# EAGLE schematic stepper  carriers (EAGLE 6.4)
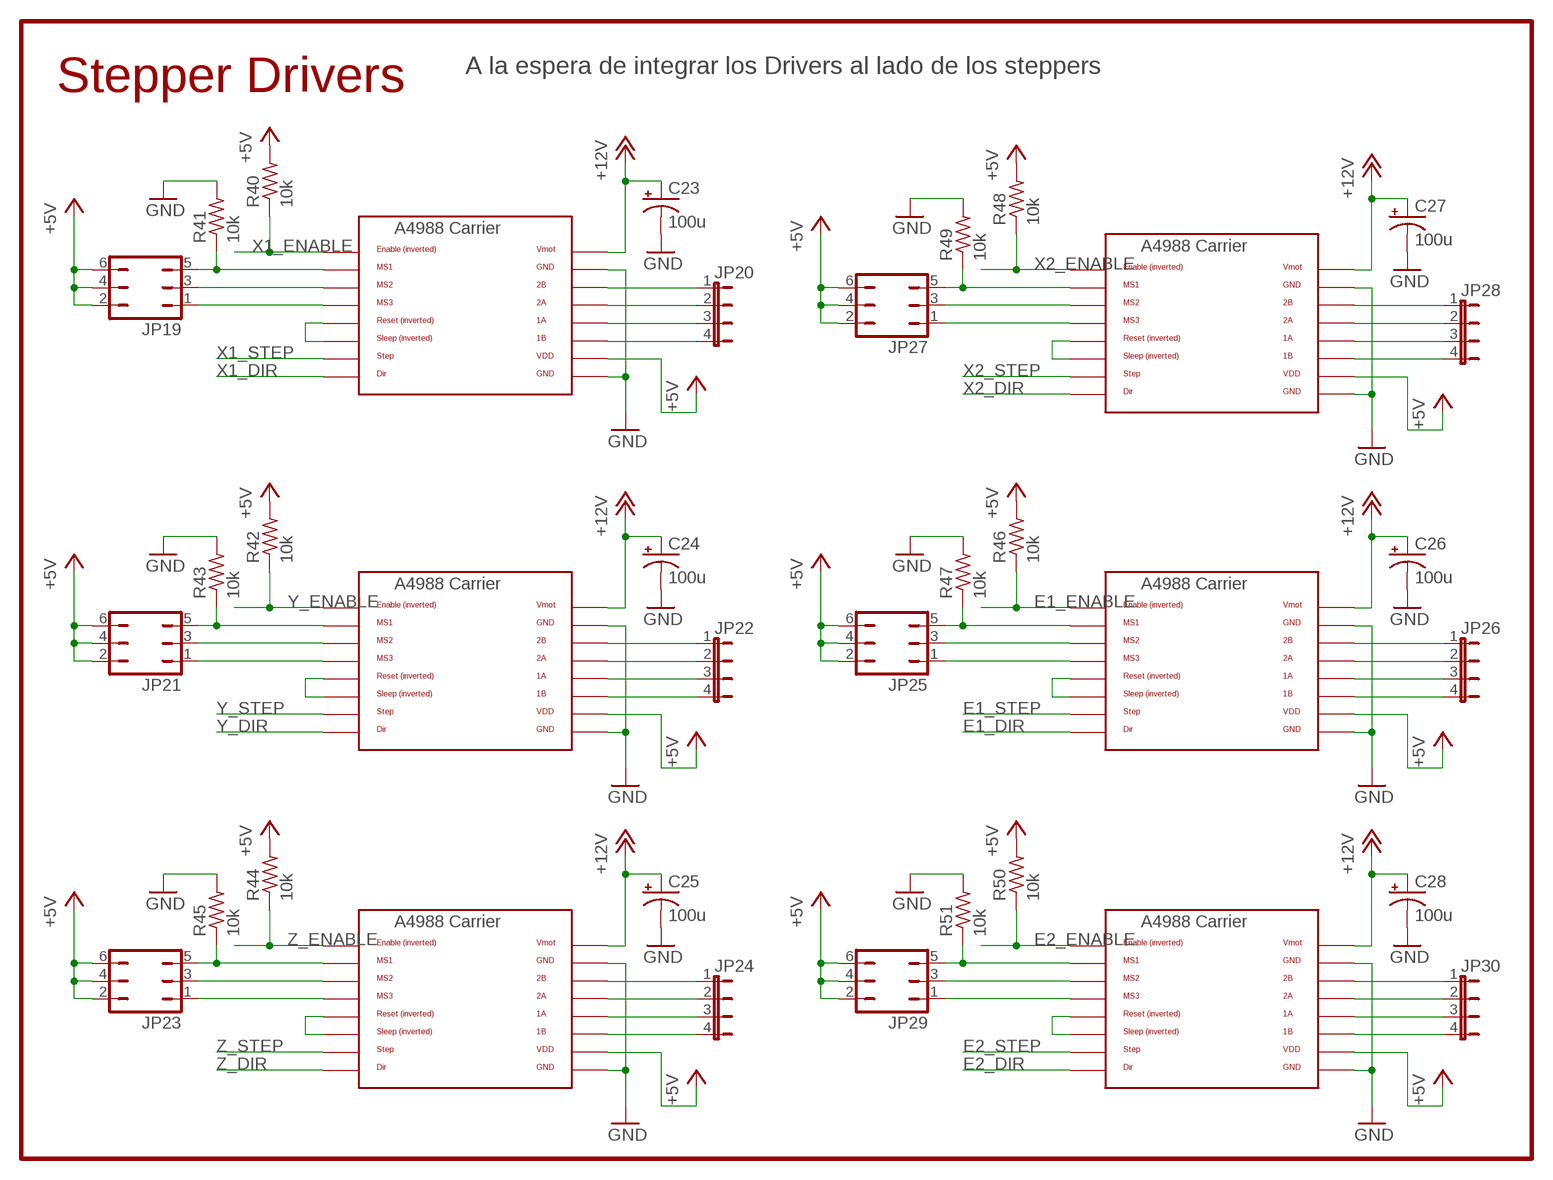
[diagram p0: schematic, sheet 1]

## Parts
C23  100u  CPOL-US140CLH-1010  [140CLH-1010]
C24  100u  CPOL-US140CLH-1010  [140CLH-1010]
C25  100u  CPOL-US140CLH-1010  [140CLH-1010]
C26  100u  CPOL-US140CLH-1010  [140CLH-1010]
C27  100u  CPOL-US140CLH-1010  [140CLH-1010]
C28  100u  CPOL-US140CLH-1010  [140CLH-1010]
JP19  JP3Q  [JP3Q]
JP20  JP4E  [JP4]
JP21  JP3Q  [JP3Q]
JP22  JP4E  [JP4]
JP23  JP3Q  [JP3Q]
JP24  JP4E  [JP4]
JP25  JP3Q  [JP3Q]
JP26  JP4E  [JP4]
JP27  JP3Q  [JP3Q]
JP28  JP4E  [JP4]
JP29  JP3Q  [JP3Q]
JP30  JP4E  [JP4]
R40  10k  R-US_R0805  [R0805]
R41  10k  R-US_R0805  [R0805]
R42  10k  R-US_R0805  [R0805]
R43  10k  R-US_R0805  [R0805]
R44  10k  R-US_R0805  [R0805]
R45  10k  R-US_R0805  [R0805]
R46  10k  R-US_R0805  [R0805]
R47  10k  R-US_R0805  [R0805]
R48  10k  R-US_R0805  [R0805]
R49  10k  R-US_R0805  [R0805]
R50  10k  R-US_R0805  [R0805]
R51  10k  R-US_R0805  [R0805]
U$7  A4988BREAKOUT  [A4988BREAKOUT]
U$8  A4988BREAKOUT  [A4988BREAKOUT]
U$9  A4988BREAKOUT  [A4988BREAKOUT]
U$10  A4988BREAKOUT  [A4988BREAKOUT]
U$11  A4988BREAKOUT  [A4988BREAKOUT]
U$12  A4988BREAKOUT  [A4988BREAKOUT]

## Nets
+5V: JP19.2 JP19.4 JP19.6 JP21.2 JP21.4 JP21.6 JP23.2 JP23.4 JP23.6 JP25.2 JP25.4 JP25.6 JP27.2 JP27.4 JP27.6 JP29.2 JP29.4 JP29.6 R40.2 R42.2 R44.2 R46.2 R48.2 R50.2 U$7.VDD U$8.VDD U$9.VDD U$10.VDD U$11.VDD U$12.VDD
+24V: C23.+ C24.+ C25.+ C26.+ C27.+ C28.+ U$7.VMOT U$8.VMOT U$9.VMOT U$10.VMOT U$11.VMOT U$12.VMOT ; supply symbol labelled +12V
E1_DIR: U$10.DIR
E1_ENABLE: R46.1 U$10.EN
E1_STEP: U$10.STEP
E2_DIR: U$12.DIR
E2_ENABLE: R50.1 U$12.EN
E2_STEP: U$12.STEP
GND: C23.- C24.- C25.- C26.- C27.- C28.- R41.2 R43.2 R45.2 R47.2 R49.2 R51.2 U$7.GND U$7.GND@0(GND) U$8.GND U$8.GND@0(GND) U$9.GND U$9.GND@0(GND) U$10.GND U$10.GND@0(GND) U$11.GND U$11.GND@0(GND) U$12.GND U$12.GND@0(GND)
N$164: U$7.RST U$7.SLP(SLEEP)
N$165: JP19.5 R41.1 U$7.MS1
N$166: JP19.3 U$7.MS2
N$167: JP19.1 U$7.MS3
N$168: JP20.1 U$7.2B
N$169: JP20.2 U$7.2A
N$170: JP20.3 U$7.1A
N$171: JP20.4 U$7.1B
N$172: U$8.RST U$8.SLP(SLEEP)
N$173: JP21.5 R43.1 U$8.MS1
N$174: JP21.3 U$8.MS2
N$175: JP21.1 U$8.MS3
N$176: JP22.1 U$8.2B
N$177: JP22.2 U$8.2A
N$178: JP22.3 U$8.1A
N$179: JP22.4 U$8.1B
N$180: U$9.RST U$9.SLP(SLEEP)
N$181: JP23.5 R45.1 U$9.MS1
N$182: JP23.3 U$9.MS2
N$183: JP23.1 U$9.MS3
N$184: JP24.1 U$9.2B
N$185: JP24.2 U$9.2A
N$186: JP24.3 U$9.1A
N$187: JP24.4 U$9.1B
N$188: U$10.RST U$10.SLP(SLEEP)
N$189: JP25.5 R47.1 U$10.MS1
N$190: JP25.3 U$10.MS2
N$191: JP25.1 U$10.MS3
N$192: JP26.1 U$10.2B
N$193: JP26.2 U$10.2A
N$194: JP26.3 U$10.1A
N$195: JP26.4 U$10.1B
N$196: U$11.RST U$11.SLP(SLEEP)
N$197: JP27.5 R49.1 U$11.MS1
N$198: JP27.3 U$11.MS2
N$199: JP27.1 U$11.MS3
N$200: JP28.1 U$11.2B
N$201: JP28.2 U$11.2A
N$202: JP28.3 U$11.1A
N$203: JP28.4 U$11.1B
N$204: U$12.RST U$12.SLP(SLEEP)
N$205: JP29.5 R51.1 U$12.MS1
N$206: JP29.3 U$12.MS2
N$207: JP29.1 U$12.MS3
N$208: JP30.1 U$12.2B
N$209: JP30.2 U$12.2A
N$210: JP30.3 U$12.1A
N$211: JP30.4 U$12.1B
X1_DIR: U$7.DIR
X1_ENABLE: R40.1 U$7.EN
X1_STEP: U$7.STEP
X2_DIR: U$11.DIR
X2_ENABLE: R48.1 U$11.EN
X2_STEP: U$11.STEP
Y_DIR: U$8.DIR
Y_ENABLE: R42.1 U$8.EN
Y_STEP: U$8.STEP
Z_DIR: U$9.DIR
Z_ENABLE: R44.1 U$9.EN
Z_STEP: U$9.STEP

## Notes on the sheet
- A la espera de integrar los Drivers al lado de los steppers
- Stepper Drivers

## Library data of the parts
C23-C28 = rcl:CPOL-US: POLARIZED CAPACITOR, American symbol
JP19 JP21 JP23 JP25 JP27 JP29 = jumper:JP3Q: JUMPER
JP20 JP22 JP24 JP26 JP28 JP30 = jumper:JP4E: JUMPER
R40-R51 = rcl:R-US_: RESISTOR, American symbol
U$7-U$12 = RepRapjr:A4988BREAKOUT